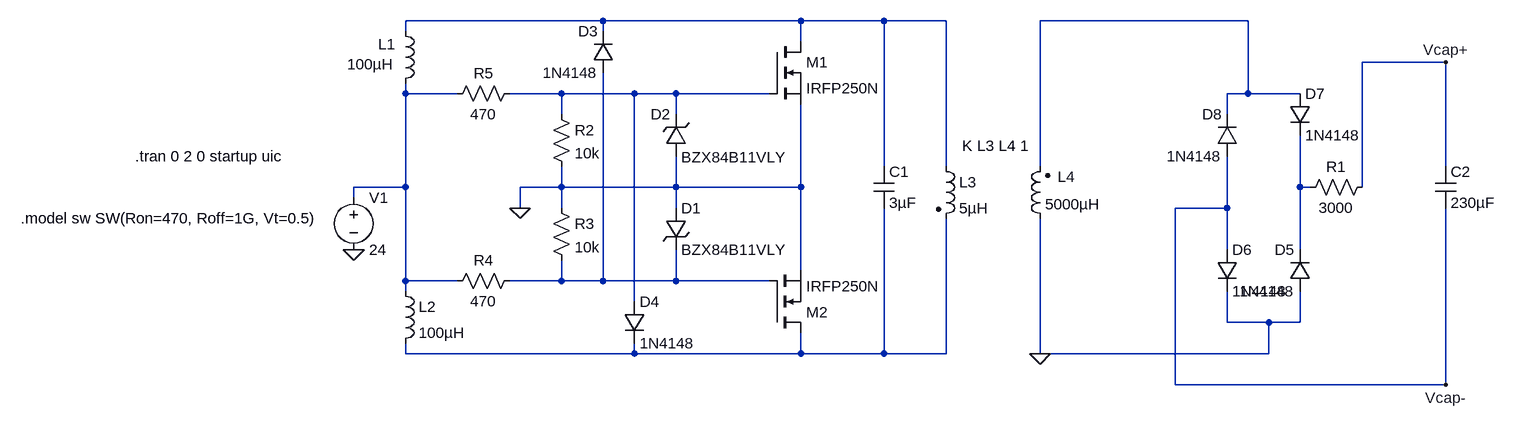
[diagram p0: schematic charge.asc]
charge.asc, the LTspice schematic file:
Version 4
SHEET 1 1880 712
WIRE 352 16 48 16
WIRE 656 16 352 16
WIRE 784 16 656 16
WIRE 880 16 784 16
WIRE 1344 16 1024 16
WIRE 48 32 48 16
WIRE 352 32 352 16
WIRE 656 48 656 16
WIRE 1648 80 1520 80
WIRE 48 128 48 112
WIRE 128 128 48 128
WIRE 288 128 208 128
WIRE 400 128 288 128
WIRE 464 128 400 128
WIRE 608 128 464 128
WIRE 1344 128 1344 16
WIRE 1344 128 1312 128
WIRE 1424 128 1344 128
WIRE 288 160 288 128
WIRE 464 160 464 128
WIRE 1312 160 1312 128
WIRE 784 240 784 16
WIRE 880 240 880 16
WIRE 1024 240 1024 16
WIRE 1648 240 1648 80
WIRE 48 272 48 128
WIRE 48 272 -32 272
WIRE 288 272 288 240
WIRE 288 272 224 272
WIRE 464 272 464 224
WIRE 464 272 288 272
WIRE 656 272 656 144
WIRE 656 272 464 272
WIRE 1424 272 1424 192
WIRE 1440 272 1424 272
WIRE 1520 272 1520 80
WIRE -32 288 -32 272
WIRE 224 304 224 272
WIRE 288 304 288 272
WIRE 464 304 464 272
WIRE 1312 304 1312 224
WIRE 1312 304 1232 304
WIRE 1312 368 1312 304
WIRE 1424 368 1424 272
WIRE 656 400 656 272
WIRE 48 416 48 272
WIRE 128 416 48 416
WIRE 288 416 288 384
WIRE 288 416 208 416
WIRE 352 416 352 96
WIRE 352 416 288 416
WIRE 464 416 464 368
WIRE 464 416 352 416
WIRE 608 416 464 416
WIRE 48 432 48 416
WIRE 400 448 400 128
WIRE 1312 480 1312 432
WIRE 1376 480 1312 480
WIRE 1424 480 1424 432
WIRE 1424 480 1376 480
WIRE 48 528 48 512
WIRE 400 528 400 512
WIRE 400 528 48 528
WIRE 656 528 656 496
WIRE 656 528 400 528
WIRE 784 528 784 304
WIRE 784 528 656 528
WIRE 880 528 880 320
WIRE 880 528 784 528
WIRE 1024 528 1024 320
WIRE 1376 528 1376 480
WIRE 1376 528 1024 528
WIRE 1232 576 1232 304
WIRE 1648 576 1648 304
WIRE 1648 576 1232 576
FLAG 224 304 0
FLAG -32 368 0
FLAG 1024 528 0
FLAG 1648 80 Vcap+
FLAG 1648 576 Vcap-
SYMBOL ind 32 16 R0
WINDOW 0 -26 36 Left 2
WINDOW 3 -74 67 Left 2
SYMATTR InstName L1
SYMATTR Value 100µH
SYMBOL ind 32 416 R0
SYMATTR InstName L2
SYMATTR Value 100µH
SYMBOL res 272 144 R0
SYMATTR InstName R2
SYMATTR Value 10k
SYMBOL res 272 288 R0
SYMATTR InstName R3
SYMATTR Value 10k
SYMBOL res 224 400 R90
WINDOW 0 0 56 VBottom 2
WINDOW 3 32 56 VTop 2
SYMATTR InstName R4
SYMATTR Value 470
SYMBOL zener 448 304 R0
SYMATTR InstName D1
SYMATTR Value BZX84B11VLY
SYMBOL zener 480 224 R180
WINDOW 0 24 64 Left 2
WINDOW 3 -153 -2 Left 2
SYMATTR InstName D2
SYMATTR Value BZX84B11VLY
SYMBOL nmos 608 48 R0
SYMATTR InstName M1
SYMATTR Value IRFP250N
SYMBOL nmos 608 496 M180
SYMATTR InstName M2
SYMATTR Value IRFP250N
SYMBOL diode 368 96 R180
WINDOW 0 24 64 Left 2
WINDOW 3 24 0 Left 2
SYMATTR InstName D3
SYMATTR Value 1N4148
SYMBOL diode 384 448 R0
SYMATTR InstName D4
SYMATTR Value 1N4148
SYMBOL cap 768 240 R0
SYMATTR InstName C1
SYMATTR Value 3µF
SYMBOL ind2 864 224 R0
SYMATTR InstName L3
SYMATTR Value 5µH
SYMATTR Type ind
SYMBOL voltage -32 272 R0
WINDOW 123 0 0 Left 0
WINDOW 39 0 0 Left 0
SYMATTR InstName V1
SYMATTR Value 24
SYMBOL ind2 1040 336 R180
WINDOW 0 -38 80 Left 2
WINDOW 3 -77 38 Left 2
SYMATTR InstName L4
SYMATTR Value 5000µH
SYMATTR Type ind
SYMBOL res 224 112 R90
WINDOW 0 0 56 VBottom 2
WINDOW 3 32 56 VTop 2
SYMATTR InstName R5
SYMATTR Value 470
SYMBOL diode 1408 128 R0
SYMATTR InstName D7
SYMATTR Value 1N4148
SYMBOL cap 1632 240 R0
SYMATTR InstName C2
SYMATTR Value 230µF
SYMBOL res 1536 256 R90
WINDOW 0 0 56 VBottom 2
WINDOW 3 32 56 VTop 2
SYMATTR InstName R1
SYMATTR Value 3000
SYMBOL diode 1440 432 R180
WINDOW 0 24 64 Left 2
WINDOW 3 24 0 Left 2
SYMATTR InstName D5
SYMATTR Value 1N4148
SYMBOL diode 1296 368 R0
SYMATTR InstName D6
SYMATTR Value 1N4148
SYMBOL diode 1328 224 R180
WINDOW 0 24 64 Left 2
WINDOW 3 24 0 Left 2
SYMATTR InstName D8
SYMATTR Value 1N4148
TEXT -368 224 Left 2 !.tran 0 2 0 startup uic
TEXT -544 320 Left 2 !.model sw SW(Ron=470, Roff=1G, Vt=0.5)
TEXT 904 208 Left 2 !K L3 L4 1

The netlist it stands for:
* charge.asc
L1 N001 N003 100µH
L2 N003 N007 100µH
R2 N004 0 10k
R3 0 N006 10k
R4 N006 N003 470
D1 0 N006 BZX84B11VLY
D2 0 N004 BZX84B11VLY
M1 N001 N004 0 0 IRFP250N
M2 N007 N006 0 0 IRFP250N
D3 N006 N001 1N4148
D4 N004 N007 1N4148
C1 N001 N007 3µF
L3 N001 N007 5µH
V1 N003 0 24
L4 0 N002 5000µH
R5 N004 N003 470
D7 N002 N005 1N4148
C2 Vcap+ Vcap- 230µF
R1 Vcap+ N005 3000
D5 0 N005 1N4148
D6 Vcap- 0 1N4148
D8 Vcap- N002 1N4148
.model D D
.lib standard.dio
.model NMOS NMOS
.model PMOS PMOS
.lib standard.mos
.tran 0 2 0 startup uic
.model sw SW(Ron=470, Roff=1G, Vt=0.5)
K L3 L4 1
.backanno
.end